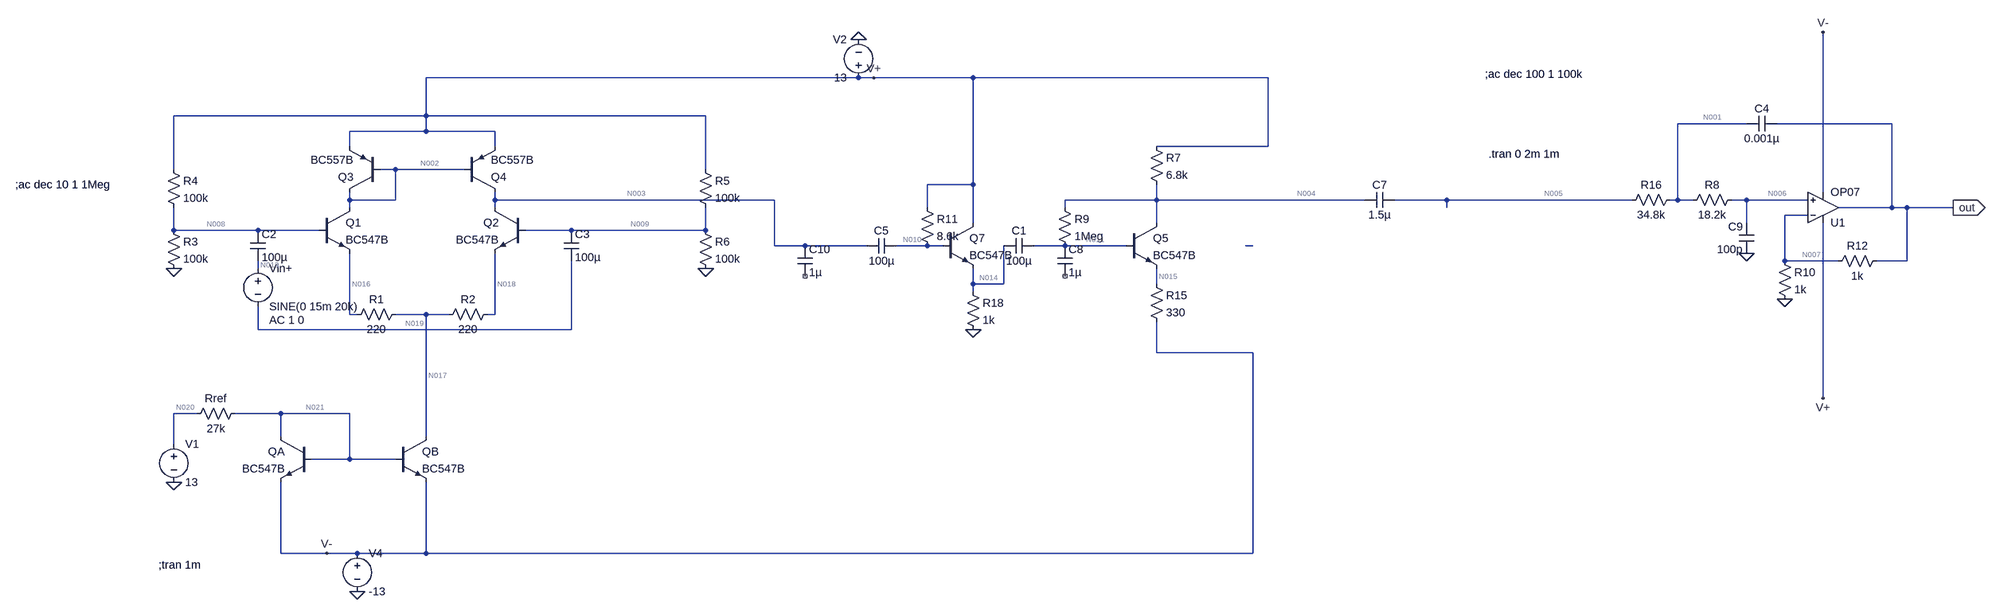
[diagram p0: schematic final_filter.asc]
final_filter.asc, the LTspice schematic file:
Version 4
SHEET 1 3744 1044
WIRE 1072 -192 160 -192
WIRE 1104 -192 1072 -192
WIRE 1312 -192 1104 -192
WIRE 1936 -192 1312 -192
WIRE 160 -112 160 -192
WIRE 160 -112 -368 -112
WIRE 752 -112 160 -112
WIRE 3216 -96 3072 -96
WIRE 3520 -96 3280 -96
WIRE 160 -80 160 -112
WIRE 160 -80 0 -80
WIRE 304 -80 160 -80
WIRE 0 -48 0 -80
WIRE 304 -48 304 -80
WIRE 1936 -48 1936 -192
WIRE 1936 -48 1696 -48
WIRE -368 0 -368 -112
WIRE 96 0 64 0
WIRE 240 0 96 0
WIRE 752 0 752 -112
WIRE 1312 32 1312 -192
WIRE 1312 32 1216 32
WIRE 3376 48 3376 -288
WIRE 0 64 0 48
WIRE 96 64 96 0
WIRE 96 64 0 64
WIRE 304 64 304 48
WIRE 896 64 304 64
WIRE 1696 64 1696 32
WIRE 1696 64 1504 64
WIRE 2336 64 1696 64
WIRE 2528 64 2400 64
WIRE 2976 64 2528 64
WIRE 3072 64 3072 -96
WIRE 3072 64 3056 64
WIRE 3104 64 3072 64
WIRE 3216 64 3184 64
WIRE 3344 64 3216 64
WIRE 0 80 0 64
WIRE 304 80 304 64
WIRE 1216 80 1216 32
WIRE 1504 80 1504 64
WIRE 2528 80 2528 64
WIRE 3520 80 3520 -96
WIRE 3520 80 3408 80
WIRE 3552 80 3520 80
WIRE 3648 80 3552 80
WIRE 3344 96 3296 96
WIRE 1312 112 1312 32
WIRE 1696 112 1696 64
WIRE 3216 112 3216 64
WIRE -368 128 -368 80
WIRE -192 128 -368 128
WIRE -64 128 -192 128
WIRE 464 128 368 128
WIRE 752 128 752 80
WIRE 752 128 464 128
WIRE 896 160 896 64
WIRE 960 160 896 160
WIRE 1088 160 960 160
WIRE 1216 160 1152 160
WIRE 1248 160 1216 160
WIRE 1504 160 1440 160
WIRE 1632 160 1504 160
WIRE 1904 160 1888 160
WIRE 3296 192 3296 96
WIRE 3408 192 3296 192
WIRE 3552 192 3552 80
WIRE 3552 192 3488 192
WIRE -192 208 -192 192
WIRE 1312 240 1312 208
WIRE 1376 240 1376 160
WIRE 1376 240 1312 240
WIRE 1696 240 1696 208
WIRE 1312 256 1312 240
WIRE 0 304 0 176
WIRE 16 304 0 304
WIRE 160 304 96 304
WIRE 208 304 160 304
WIRE 304 304 304 176
WIRE 304 304 288 304
WIRE -192 336 -192 288
WIRE 464 336 464 192
WIRE 464 336 -192 336
WIRE 1696 384 1696 320
WIRE 1904 384 1696 384
WIRE 3376 480 3376 112
WIRE -320 512 -368 512
WIRE -144 512 -240 512
WIRE 0 512 -144 512
WIRE -144 560 -144 512
WIRE 160 560 160 304
WIRE -368 576 -368 512
WIRE 0 608 0 512
WIRE 0 608 -80 608
WIRE 96 608 0 608
WIRE -144 880 -144 656
WIRE -48 880 -144 880
WIRE 16 880 -48 880
WIRE 160 880 160 656
WIRE 160 880 16 880
WIRE 1904 880 1904 384
WIRE 1904 880 160 880
FLAG -368 656 0
FLAG -368 208 0
FLAG 752 208 0
FLAG 16 960 0
FLAG 1072 -272 0
FLAG 1312 336 0
FLAG 1104 -192 V+
FLAG -48 880 V-
FLAG 3648 80 out
IOPIN 3648 80 Out
FLAG 3376 480 V+
FLAG 3376 -288 V-
FLAG 3216 176 0
FLAG 3296 272 0
SYMBOL npn 368 80 M0
SYMATTR InstName Q2
SYMATTR Value BC547B
SYMBOL npn -64 80 R0
SYMATTR InstName Q1
SYMATTR Value BC547B
SYMBOL res 112 288 R90
WINDOW 0 0 56 VBottom 2
WINDOW 3 32 56 VTop 2
SYMATTR InstName R1
SYMATTR Value 220
SYMBOL res 304 288 R90
WINDOW 0 0 56 VBottom 2
WINDOW 3 32 56 VTop 2
SYMATTR InstName R2
SYMATTR Value 220
SYMBOL npn 96 560 R0
SYMATTR InstName QB
SYMATTR Value BC547B
SYMBOL npn -80 560 M0
SYMATTR InstName QA
SYMATTR Value BC547B
SYMBOL res -224 496 R90
WINDOW 0 0 56 VBottom 2
WINDOW 3 32 56 VTop 2
SYMATTR InstName Rref
SYMATTR Value 27k
SYMBOL voltage -192 192 R0
WINDOW 123 24 124 Left 2
WINDOW 39 0 0 Left 0
SYMATTR Value2 AC 1 0
SYMATTR InstName Vin+
SYMATTR Value SINE(0 15m 20k)
SYMBOL voltage -368 560 R0
WINDOW 123 0 0 Left 0
WINDOW 39 0 0 Left 0
SYMATTR InstName V1
SYMATTR Value 13
SYMBOL cap -208 128 R0
SYMATTR InstName C2
SYMATTR Value 100µ
SYMBOL res -384 112 R0
SYMATTR InstName R3
SYMATTR Value 100k
SYMBOL res -384 -16 R0
SYMATTR InstName R4
SYMATTR Value 100k
SYMBOL res 736 -16 R0
SYMATTR InstName R5
SYMATTR Value 100k
SYMBOL res 736 112 R0
SYMATTR InstName R6
SYMATTR Value 100k
SYMBOL npn 1632 112 R0
SYMATTR InstName Q5
SYMATTR Value BC547B
SYMBOL res 1680 -64 R0
SYMATTR InstName R7
SYMATTR Value 6.8k
SYMBOL cap 1440 144 R90
WINDOW 0 0 32 VBottom 2
WINDOW 3 32 32 VTop 2
SYMATTR InstName C1
SYMATTR Value 100µ
SYMBOL cap 1152 144 R90
WINDOW 0 0 32 VBottom 2
WINDOW 3 32 32 VTop 2
SYMATTR InstName C5
SYMATTR Value 100µ
SYMBOL res 1680 224 R0
SYMATTR InstName R15
SYMATTR Value 330
SYMBOL res 1488 64 R0
SYMATTR InstName R9
SYMATTR Value 1Meg
SYMBOL cap 448 128 R0
SYMATTR InstName C3
SYMATTR Value 100µ
SYMBOL voltage 16 864 R0
WINDOW 123 0 0 Left 0
WINDOW 39 0 0 Left 0
SYMATTR InstName V4
SYMATTR Value -13
SYMBOL voltage 1072 -176 R180
WINDOW 0 24 96 Left 2
WINDOW 3 24 16 Left 2
WINDOW 123 0 0 Left 0
WINDOW 39 0 0 Left 0
SYMATTR InstName V2
SYMATTR Value 13
SYMBOL pnp 64 48 R180
SYMATTR InstName Q3
SYMATTR Value BC557B
SYMBOL pnp 240 48 M180
SYMATTR InstName Q4
SYMATTR Value BC557B
SYMBOL cap 2400 48 R90
WINDOW 0 0 32 VBottom 2
WINDOW 3 32 32 VTop 2
SYMATTR InstName C7
SYMATTR Value 1.5µ
SYMBOL npn 1248 112 R0
SYMATTR InstName Q7
SYMATTR Value BC547B
SYMBOL res 1200 64 R0
SYMATTR InstName R11
SYMATTR Value 8.6k
SYMBOL res 1296 240 R0
SYMATTR InstName R18
SYMATTR Value 1k
SYMBOL cap 1488 160 R0
SYMATTR InstName C8
SYMATTR Value 1µ
SYMBOL cap 944 160 R0
SYMATTR InstName C10
SYMATTR Value 1µ
SYMBOL OpAmps\\OP07 3376 144 M180
SYMATTR InstName U1
SYMBOL res 3072 48 R90
WINDOW 0 0 56 VBottom 2
WINDOW 3 32 56 VTop 2
SYMATTR InstName R16
SYMATTR Value 34.8k
SYMBOL cap 3232 176 R180
WINDOW 0 24 56 Left 2
WINDOW 3 24 8 Left 2
SYMATTR InstName C9
SYMATTR Value 100p
SYMBOL res 3200 48 R90
WINDOW 0 0 56 VBottom 2
WINDOW 3 32 56 VTop 2
SYMATTR InstName R8
SYMATTR Value 18.2k
SYMBOL cap 3280 -112 R90
WINDOW 0 0 32 VBottom 2
WINDOW 3 32 32 VTop 2
SYMATTR InstName C4
SYMATTR Value 0.001µ
SYMBOL res 3280 176 R0
SYMATTR InstName R10
SYMATTR Value 1k
SYMBOL res 3504 176 R90
WINDOW 0 0 56 VBottom 2
WINDOW 3 32 56 VTop 2
SYMATTR InstName R12
SYMATTR Value 1k
TEXT -400 904 Left 2 !;tran 1m
TEXT -760 32 Left 2 !;ac dec 10 1 1Meg
TEXT 2616 -32 Left 2 !.tran 0 2m 1m
TEXT 2608 -200 Left 2 !;ac dec 100 1 100k

The netlist it stands for:
* final_filter.asc
Q2 N003 N009 N018 0 BC547B
Q1 N002 N008 N016 0 BC547B
R1 N017 N016 220
R2 N018 N017 220
QB N017 N021 V- 0 BC547B
QA N021 N021 V- 0 BC547B
Rref N021 N020 27k
Vin+ N013 N019 SINE(0 15m 20k) AC 1 0
V1 N020 0 13
C2 N008 N013 100µ
R3 N008 0 100k
R4 V+ N008 100k
R5 V+ N009 100k
R6 N009 0 100k
Q5 N004 N011 N015 0 BC547B
R7 V+ N004 6.8k
C1 N011 N014 100µ
C5 N010 N003 100µ
R15 N015 V- 330
R9 N004 N011 1Meg
C3 N009 N019 100µ
V4 V- 0 -13
V2 V+ 0 13
Q3 N002 N002 V+ 0 BC557B
Q4 N003 N002 V+ 0 BC557B
C7 N005 N004 1.5µ
Q7 V+ N010 N014 0 BC547B
R11 V+ N010 8.6k
R18 N014 0 1k
C8 N011 NC_01 1µ
C10 N003 NC_02 1µ
XU1 N006 N007 V+ V- out LT1001  ; OP07, pins In+ In- V+ V- OUT
R16 N001 N005 34.8k
C9 0 N006 100p
R8 N006 N001 18.2k
C4 out N001 0.001µ
R10 N007 0 1k
R12 out N007 1k
.model NPN NPN
.model PNP PNP
.lib standard.bjt
;tran 1m
;ac dec 10 1 1Meg
.tran 0 2m 1m
;ac dec 100 1 100k
.lib LTC.lib
.backanno
.end

* Results of the author's LTspice run, read from the files saved beside the schematic
* Operating Point, zero values left out:
*   V(n003) = 12.27 V
*   V(n009) = 6.404 V
*   V(n018) = 5.781 V
*   V(n002) = 12.39 V
*   V(n008) = 6.404 V
*   V(n016) = 5.781 V
*   V(n017) = 5.649 V
*   V(n021) = -12.36 V
*   V(v-) = -13 V
*   V(n020) = 13 V
*   V(n013) = 1.28 mV
*   V(n019) = 1.28 mV
*   V(v+) = 13 V
*   V(n004) = -3.748 V
*   V(n011) = -11.53 V
*   V(n015) = -12.19 V
*   V(n014) = 11.9 V
*   V(n010) = 12.61 V
*   V(n005) = -3.084 µV
*   V(n007) = -3.084 µV
*   V(n006) = -3.084 µV
*   V(out) = -6.169 µV
*   V(n001) = -3.084 µV
*   Ic(Q4) = -597.6 µA
*   Ib(Q4) = -1.838 µA
*   Ie(Q4) = 599.5 µA
*   Ic(Q3) = -594.4 µA
*   Ib(Q3) = -1.839 µA
*   Ie(Q3) = 596.3 µA
*   Ic(Q7) = 11.86 mA
*   Ib(Q7) = 45.01 µA
*   Ie(Q7) = -11.9 mA
*   Ic(Q5) = 2.455 mA
*   Ib(Q5) = 7.779 µA
*   Ie(Q5) = -2.463 mA
*   Ic(Qa) = 932.8 µA
*   Ib(Qa) = 3.303 µA
*   Ie(Qa) = -936.1 µA
*   Ic(Qb) = 1.2 mA
*   Ib(Qb) = 3.287 µA
*   Ie(Qb) = -1.203 mA
*   Ic(Q1) = 598.1 µA
*   Ib(Q1) = 1.928 µA
*   Ie(Q1) = -600 µA
*   Ic(Q2) = 597.6 µA
*   Ib(Q2) = 1.929 µA
*   Ie(Q2) = -599.6 µA
*   I(R12) = -3.084 nA
*   I(R10) = -3.084 nA
*   I(R18) = 11.9 mA
*   I(R11) = 45.01 µA
*   I(R9) = 7.779 µA
*   I(R15) = 2.463 mA
*   I(R7) = 2.463 mA
*   I(R6) = 64.04 µA
*   I(R5) = 65.96 µA
*   I(R4) = 65.96 µA
*   I(R3) = 64.04 µA
*   I(Rref) = -939.4 µA
*   I(R2) = 599.6 µA
*   I(R1) = -600 µA
*   I(V2) = -17.94 mA
*   I(V4) = 6.852 mA
*   I(V1) = -939.4 µA
*   Ix(u1:3) = 2.25 mA
*   Ix(u1:4) = -2.25 mA
*   Ix(u1:5) = 3.084 nA
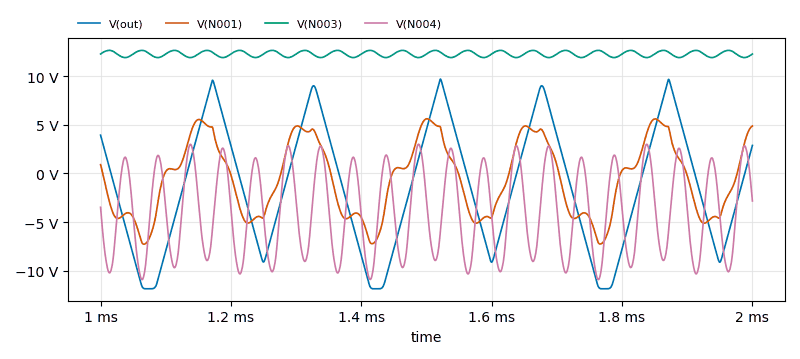
[diagram p1: Transient Analysis of final_filter.asc, plotted from the saved traces]
* Transient Analysis, 1 run:
*   V(out): min -11.86 V, max 9.688 V, average -1.536 V, rms 6.396 V, last 2.872 V
*   V(N001): min -7.272 V, max 5.615 V, average -572.3 mV, rms 3.879 V, last 4.87 V
*   V(N003): min 11.9 V, max 12.64 V, average 12.27 V, rms 12.28 V, last 12.27 V
*   V(N004): min -10.91 V, max 3.004 V, average -3.841 V, rms 5.818 V, last -2.837 V